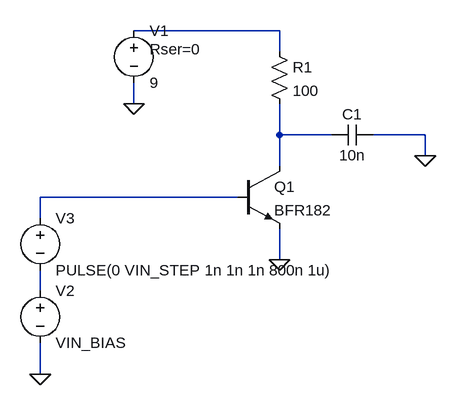
[diagram p0: schematic Draft1.asc]
Draft1.asc, the LTspice schematic file:
Version 4
SHEET 1 880 680
WIRE 256 -96 32 -96
WIRE 256 -64 256 -96
WIRE 32 16 32 -16
WIRE 256 64 256 16
WIRE 336 64 256 64
WIRE 480 64 400 64
WIRE 480 96 480 64
WIRE 256 112 256 64
WIRE 192 160 -112 160
WIRE -112 192 -112 160
WIRE 256 256 256 208
WIRE -112 304 -112 272
WIRE -112 432 -112 384
FLAG 256 256 0
FLAG 480 96 0
FLAG 32 16 0
FLAG -112 432 0
SYMBOL npn 192 112 R0
SYMATTR InstName Q1
SYMATTR Value BFR182
SYMBOL res 240 -80 R0
SYMATTR InstName R1
SYMATTR Value 100
SYMBOL cap 400 48 R90
WINDOW 0 0 32 VBottom 2
WINDOW 3 32 32 VTop 2
SYMATTR InstName C1
SYMATTR Value 10n
SYMBOL voltage 32 -112 R0
WINDOW 123 0 0 Left 0
WINDOW 39 24 44 Left 2
SYMATTR InstName V1
SYMATTR Value 9
SYMATTR SpiceLine Rser=0
SYMBOL voltage -112 288 R0
WINDOW 123 0 0 Left 0
WINDOW 39 0 0 Left 0
SYMATTR InstName V2
SYMATTR Value VIN_BIAS
SYMBOL voltage -112 176 R0
WINDOW 123 0 0 Left 0
WINDOW 39 0 0 Left 0
SYMATTR InstName V3
SYMATTR Value PULSE(0 VIN_STEP 1n 1n 1n 800n 1u)

The netlist it stands for:
* Draft1.asc
Q1 N002 N003 0 0 BFR182
R1 N001 N002 100
C1 0 N002 10n
V1 N001 0 9 Rser=0
V2 N004 0 VIN_BIAS
V3 N003 N004 PULSE(0 VIN_STEP 1n 1n 1n 800n 1u)
.model NPN NPN
.model PNP PNP
.lib standard.bjt
.backanno
.end